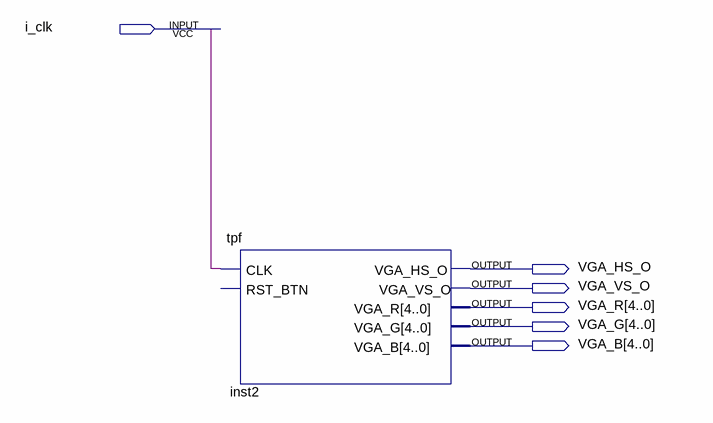
[diagram p0: schematic sheet]
// Quartus schematic Block1.bdf as structural Verilog: 1 symbols, 6 pins
module Block1 (
  input  i_clk,
  output VGA_HS_O,
  output VGA_VS_O,
  output [4:0] VGA_R,
  output [4:0] VGA_G,
  output [4:0] VGA_B
);

  wire undriven, undriven_2;

  tpf inst2 (
    .CLK(undriven_2), .RST_BTN(undriven), .VGA_HS_O(VGA_HS_O), .VGA_VS_O(VGA_VS_O), .VGA_R(VGA_R),
    .VGA_G(VGA_G), .VGA_B(VGA_B));
endmodule
